# Altium schematic sheet 002_Servos.SchDoc
size A4; SheetNumber: 3; SheetTotal: 3; SPICEModelCacheWCGIBJUX: <root> / <DocumentId>WCGIBJUX</DocumentId> / <CacheFrame Number="0"> / <Model Name="0603_150060bs75003" Kind="CKT"> / <Text>****** / .subckt 0603_150060BS75003  1  2 / D1 1 2 SMCW / .MODEL SMCW D / + IS=695.94E-6 / + N=5 / + RS=2.4677 / + IKF=16.109E-12 / + CJO=1.0000E-12 / + M=.3333 / + VJ=.75 / + BV=5 / + IBV=10.00E-6 / + TT=5.0000E-9 / .ends</Text> / </Model> / <Model Name="1210_885012209048_4.7uf" Kind="CKT"> / <Text>******* / .subckt 1210_885012209048_4.7uF 1 2 / Rser 1 3 0.00278836774782 / Lser 2 4 2.60340728E-10 / C1 3 4 0.0000047 / Rpar 3 4 20000000 / .ends 1210_885012209048_4.7uF</Text> / </Model> / <Model Name="1812_885012210032_2.2uf" Kind="CKT"> / <Text>******* / .subckt 1812_885012210032_2.2uF 1 2 / Rser 1 3 0.00377371050938 / Lser 2 4 4.19292053E-10 / C1 3 4 0.0000022 / Rpar 3 4 200000000 / .ends 1812_885012210032_2.2uF</Text> / </Model> / <Model Name="0603_150060rs75003" Kind="CKT"> / <Text>****** / .subckt 0603_150060RS75003  1  2 / D1 1 2 SMCW / .MODEL SMCW D / + IS=1.0025E-15 / + N=2.2259 / + RS=.3926 / + IKF=240.91E-6 / + CJO=1.0000E-12 / + M=.3333 / + VJ=.75 / + BV=5 / + IBV=10.00E-6 / + TT=5.0000E-9 / .ends</Text> / </Model> / </CacheFrame> / </root>
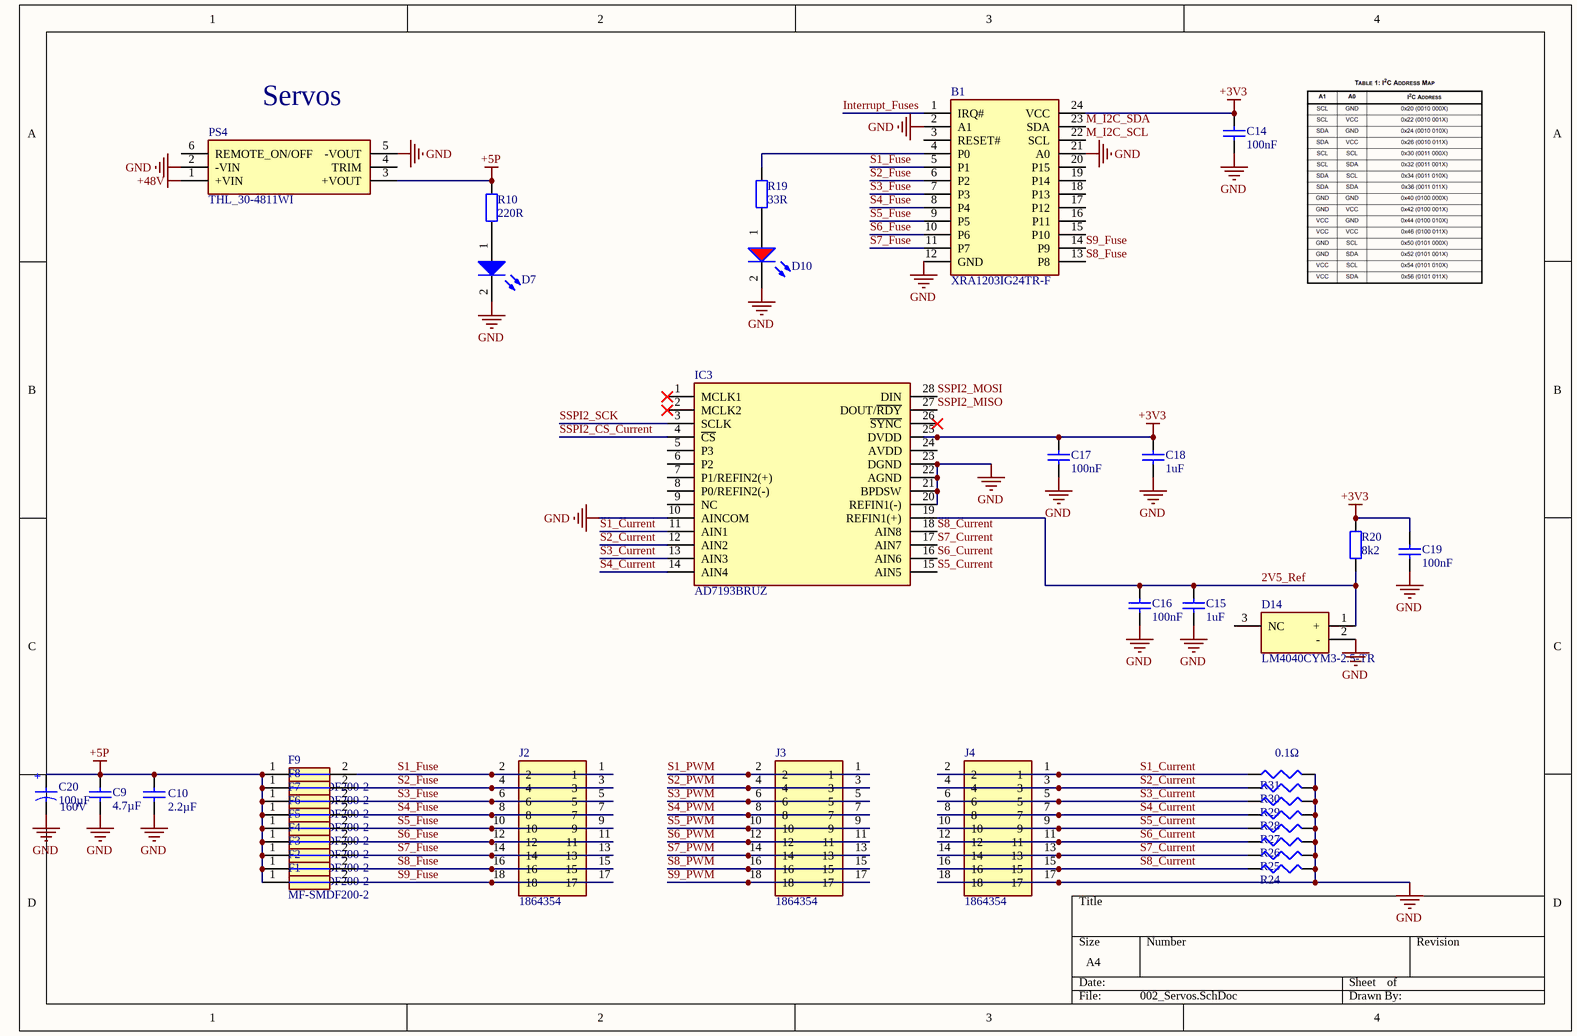
[diagram p0: 002_Servos.SchDoc]

## Parts
B1  XRA1203IG24TR-F  [SOP65P640X120-24N]
C9  4.7µF  [WCAP-CSGP_1210_L3.2W2.5H2.5]
C10  2.2µF  [WCAP-CSGP_1812_L4.5W3.2H2.5]
C14  100nF  [6-0805_L]
C15  1uF  [6-0805_L]
C16  100nF  [6-0805_L]
C17  100nF  [6-0805_L]
C18  1uF  [6-0805_L]
C19  100nF  [6-0805_L]
C20  Rated Voltage (DC): 160V  [WCAP-AT1H_D18H21]  (hidden comment: 100µF)
D7  Blue, 3.2V, 140°  [WL-SMCW_0603_150060xx75003]  (value not drawn)
D10  Red, 2V, 140°  [WL-SMCW_0603_150060xx75003]  (value not drawn)
D14  LM4040CYM3-2.5-TR  [SOT - 23]
F1  MF-SMDF200-2  [FUSC5146X85N]
F2  MF-SMDF200-2  [FUSC5146X85N]
F3  MF-SMDF200-2  [FUSC5146X85N]
F4  MF-SMDF200-2  [FUSC5146X85N]
F5  MF-SMDF200-2  [FUSC5146X85N]
F6  MF-SMDF200-2  [FUSC5146X85N]
F7  MF-SMDF200-2  [FUSC5146X85N]
F8  MF-SMDF200-2  [FUSC5146X85N]
F9  MF-SMDF200-2  [FUSC5146X85N]
IC3  AD7193BRUZ  [SOP65P640X120-28N]
J2  1864354  [1864354]
J3  1864354  [1864354]
J4  1864354  [1864354]
PS4  THL_30-4811WI  [THL304811WI]
R10  220R  [6-0805_M]
R19  33R  [6-0805_M]
R20  8k2  [6-0805_M]
R24  0.1Ω  [WRIS-KSKE_0805_L2W1.25H0.6]  (value not drawn)
R25  0.1Ω  [WRIS-KSKE_0805_L2W1.25H0.6]  (value not drawn)
R26  0.1Ω  [WRIS-KSKE_0805_L2W1.25H0.6]  (value not drawn)
R27  0.1Ω  [WRIS-KSKE_0805_L2W1.25H0.6]  (value not drawn)
R28  0.1Ω  [WRIS-KSKE_0805_L2W1.25H0.6]  (value not drawn)
R29  0.1Ω  [WRIS-KSKE_0805_L2W1.25H0.6]  (value not drawn)
R30  0.1Ω  [WRIS-KSKE_0805_L2W1.25H0.6]  (value not drawn)
R31  0.1Ω  [WRIS-KSKE_0805_L2W1.25H0.6]

## Nets
+3V3: B1.24(VCC) C14.2 C17.2 C18.2 C19.2 IC3.25(DVDD) R20.2
+5P: C9.2 C10.2 C20.1(P) F1.1 F2.1 F3.1 F4.1 F5.1 F6.1 F7.1 F8.1 F9.1 PS4.3(+VOUT) R10.2
+48V: PS4.1(+VIN)
GND: B1.2(A1) B1.12(GND) B1.21(A0) C9.1 C10.1 C14.1 C15.1 C16.1 C17.1 C18.1 C19.1 C20.2(N) D7.2(K) D10.2(K) D14.2(-) IC3.10(AINCOM) IC3.20(REFIN1(-)) IC3.21(BPDSW) IC3.22(AGND) IC3.23(DGND) J4.17 J4.18 PS4.2(-VIN) PS4.5(-VOUT) R24.2 R25.2 R26.2 R27.2 R28.2 R29.2 R30.2 R31.2
2V5_Ref: C15.2 C16.2 D14.1(+) IC3.19(REFIN1(+)) R20.1
Interrupt_Fuses: B1.1(IRQ#)
M_I2C_SCL: B1.22(SCL)
M_I2C_SDA: B1.23(SDA)
S1_Current: IC3.11(AIN1) J4.1 J4.2 R31.1
S1_Fuse: B1.5(P1) F9.2 J2.1 J2.2
S1_PWM: J3.1 J3.2
S2_Current: IC3.12(AIN2) J4.3 J4.4 R30.1
S2_Fuse: B1.6(P2) F8.2 J2.3 J2.4
S2_PWM: J3.3 J3.4
S3_Current: IC3.13(AIN3) J4.5 J4.6 R29.1
S3_Fuse: B1.7(P3) F7.2 J2.5 J2.6
S3_PWM: J3.5 J3.6
S4_Current: IC3.14(AIN4) J4.7 J4.8 R28.1
S4_Fuse: B1.8(P4) F6.2 J2.7 J2.8
S4_PWM: J3.7 J3.8
S5_Current: IC3.15(AIN5) J4.9 J4.10 R27.1
S5_Fuse: B1.9(P5) F5.2 J2.9 J2.10
S5_PWM: J3.9 J3.10
S6_Current: IC3.16(AIN6) J4.11 J4.12 R26.1
S6_Fuse: B1.10(P6) F4.2 J2.11 J2.12
S6_PWM: J3.11 J3.12
S7_Current: IC3.17(AIN7) J4.13 J4.14 R25.1
S7_Fuse: B1.11(P7) F3.2 J2.13 J2.14
S7_PWM: J3.13 J3.14
S8_Current: IC3.18(AIN8) J4.15 J4.16 R24.1
S8_Fuse: B1.13(P8) F2.2 J2.15 J2.16
S8_PWM: J3.15 J3.16
S9_Fuse: B1.14(P9) F1.2 J2.17 J2.18
S9_PWM: J3.17 J3.18
SSPI2_CS_Current: IC3.4(~{CS})
SSPI2_MISO: IC3.27(DOUT/~{RDY})
SSPI2_MOSI: IC3.28(DIN)
SSPI2_SCK: IC3.3(SCLK)
NetB1_4: B1.4(P0) R19.2
NetD7_1: D7.1(A) R10.1
NetD10_1: D10.1(A) R19.1

Not connected (* = marked no-connect by the designer): B1 3(RESET#) 15(P10) 16(P11) 17(P12) 18(P13) 19(P14) 20(P15); D14 3(NC); IC3 1(MCLK1)* 2(MCLK2)* 5(P3) 6(P2) 7(P1/REFIN2(+)) 8(P0/REFIN2(-)) 9(NC) 24(AVDD) 26(~{SYNC})*; PS4 4(TRIM) 6(REMOTE_ON/OFF)

## Notes on the sheet
- (near PS4) Servos
- (in symbol 860240981006) +

## Library data of the parts
B1 = XRA1203IG24TR-F: Interface - I/O Expanders 16 Bit I2C GPIO Expander; Manufacturer_Name: EXAR; Geometry.Height: 1.2mm; Mouser Part Number: 701-XRA1203IG24TR-F; Mouser Price/Stock: https://www.mouser.com/Search/Refine.aspx?Keyword=701-XRA1203IG24TR-F; Manufacturer_Part_Number: XRA1203IG24TR-F; Datasheet Link: https://componentsearchengine.com/Datasheets/1/XRA1203IG24TR-F.pdf
C9 = 885012209048: WCAP-CSGP Multilayer Ceramic Chip Capacitor, General Purpose, size 1210, X7R, 4.7µF, 50VDC; Manufacturer: Wurth Elektronik; Case/Size Code: 1210; Capacitance Tolerance: +/-10%; Dissipation Factor: 5%; Insulation Resistance: 0.02GΩ; Rated Voltage (DC): 50V; Technical Reference: X7R1210475K050DFCT10000; Manufacturer Part Number: 885012209048; Category: Multilayer Ceramic Chip Capacitors; Match Code: WCAP-CSGP; ComponentLink1Description: Website Link; ComponentLink1URL: https://www.we-online.com/redexpert/article/885012209048?ad; ComponentLink2Description: Datasheet Link; ComponentLink2URL: https://www.we-online.com/redexpert/spec/885012209048?ad; Mount: Surface Mount; Operating Temperature Max: 125°C; Operating Temperature Min: -55°C; Packaging: Tape and Reel; Length: 3.2mm; Width: 2.5mm; Height: 2.5mm; Capacitance: 4.7µF; Ceramic Type: X7R
C10 = 885012210032: WCAP-CSGP Multilayer Ceramic Chip Capacitor, General Purpose, size 1812, X7R, 2.2µF, 50VDC; Manufacturer: Wurth Elektronik; Case/Size Code: 1812; Capacitance Tolerance: +/-10%; Dissipation Factor: 2.5%; Insulation Resistance: 0.2GΩ; Rated Voltage (DC): 50V; Technical Reference: X7R1812225K050DFCT10000; Manufacturer Part Number: 885012210032; Category: Multilayer Ceramic Chip Capacitors; Match Code: WCAP-CSGP; ComponentLink1Description: Website Link; ComponentLink1URL: https://www.we-online.com/redexpert/article/885012210032?ad; ComponentLink2Description: Datasheet Link; ComponentLink2URL: https://www.we-online.com/redexpert/spec/885012210032?ad; Mount: Surface Mount; Operating Temperature Max: 125°C; Operating Temperature Min: -55°C; Packaging: Tape and Reel; Length: 4.5mm; Width: 3.2mm; Height: 2.5mm; Capacitance: 2.2µF; Ceramic Type: X7R
C14-C19 = Cap: Capacitor; Published: 8-Jun-2000; LatestRevisionDate: 17-Jul-2002; LatestRevisionNote: Re-released for DXP Platform.; PackageReference: RAD-0.3; Publisher: Altium Limited; PackageDescription: Radial Cap, Thru-Hole; 2 Leads; 0.3 in Pin Spacing
  C14 C16 C17 C19: Value: 100nF
  C15 C18: Value: 1uF
C20 = 860240981006: WCAP-AT1H Aluminum Electrolytic Capacitor, Radial, THT, D18 x H21mm, 100µF, 160V; Manufacturer: Wurth Elektronik; Capacitance Tolerance: +/-20%; Dissipation Factor: 15%; Endurance: 10000h; Leakage Current: 740µA; Ripple Current: 1310mA; Technical Reference: ATDL210101M160DSPAEK000; Manufacturer Part Number: 860240981006; Category: Aluminum Electrolytic Capacitors; Match Code: WCAP-AT1H; ComponentLink1Description: Website Link; ComponentLink1URL: https://www.we-online.com/redexpert/article/860240981006?ad; ComponentLink2Description: Datasheet Link; ComponentLink2URL: https://www.we-online.com/redexpert/spec/860240981006?ad; Mount: Through Hole; Operating Temperature Max: 105°C; Operating Temperature Min: -40°C; Packaging: Ammo Pack; Height: 21mm; Diameter: 18mm; Capacitance: 100µF
D7 = 150060BS75003: WL-SMCW Mono-color Chip LED Waterclear, size 0603, Blue, 3.2V, 140°; Manufacturer: Wurth Elektronik; Case/Size Code: 0603; Chip Technology: InGaN; Dominant Wavelength: 470nm; Luminous Intensity: 350mcd; Peak Wavelength: 465nm; Manufacturer Part Number: 150060BS75003; Category: Signal LEDs; Match Code: WL-SMCW; ComponentLink1Description: Website Link; ComponentLink1URL: https://www.we-online.com/redexpert/article/150060BS75003?ad; ComponentLink2Description: Datasheet Link; ComponentLink2URL: https://www.we-online.com/redexpert/spec/150060BS75003?ad; Mount: Surface Mount; Operating Temperature Max: 100°C; Operating Temperature Min: -40°C; Packaging: Tape and Reel; Length: 1.6mm; Width: 0.8mm; Height: 0.7mm; Emitting Color: Blue; Forward Voltage: 3.2V; Viewing Angle: 140°
D10 = 150060RS75003: WL-SMCW Mono-color Chip LED Waterclear, size 0603, Red, 2V, 140°; Manufacturer: Wurth Elektronik; Case/Size Code: 0603; Chip Technology: AlInGaP; Dominant Wavelength: 625nm; Luminous Intensity: 530mcd; Peak Wavelength: 630nm; Manufacturer Part Number: 150060RS75003; Category: Signal LEDs; Match Code: WL-SMCW; ComponentLink1Description: Website Link; ComponentLink1URL: https://www.we-online.com/redexpert/article/150060RS75003?ad; ComponentLink2Description: Datasheet Link; ComponentLink2URL: https://www.we-online.com/redexpert/spec/150060RS75003?ad; Mount: Surface Mount; Operating Temperature Max: 100°C; Operating Temperature Min: -40°C; Packaging: Tape and Reel; Length: 1.6mm; Width: 0.8mm; Height: 0.7mm; Emitting Color: Red; Forward Voltage: 2V; Viewing Angle: 140°
D14 = LM4040CYM3-2.5-TR: Integrated Circuit; Manufacturer_Name: Microchip; Datasheet Link: https://componentsearchengine.com/Datasheets/1/LM4040CYM3-2.5-TR.pdf; Height: 1.11mm; Manufacturer_Part_Number: LM4040CYM3-2.5-TR; Mouser Part Number: 998-LM4040CYM3-2.5TR; Mouser Price/Stock: https://www.mouser.co.uk/ProductDetail/Microchip-Technology/LM4040CYM3-2.5-TR?qs=Y3Q3JoKAO1TBY3WS5dYgqA%3D%3D; Arrow Part Number: LM4040CYM3-2.5-TR; Arrow Price/Stock: https://www.arrow.com/en/products/lm4040cym3-2.5-tr/microchip-technology?region=nac
F1-F9 = MF-SMDF200-2: Fuse; Manufacturer_Name: Bourns; Datasheet Link: https://www.bourns.com/docs/product-datasheets/mf-smdf.pdf?sfvrsn=df432e3c_40; Height: 0.85mm; Manufacturer_Part_Number: MF-SMDF200-2; Mouser Part Number: 652-MF-SMDF200-2; Mouser Price/Stock: https://www.mouser.co.uk/ProductDetail/Bourns/MF-SMDF200-2?qs=NmEazmuVvbUP9opuVlBLcQ%3D%3D; Arrow Part Number: MF-SMDF200-2; Arrow Price/Stock: https://www.arrow.com/en/products/mf-smdf200-2/bourns?region=nac
IC3 = AD7193BRUZ: Integrated Circuit; Manufacturer_Name: Analog Devices; Datasheet Link: https://www.arrow.com/en/products/ad7193bruz/analog-devices; Height: 1.2mm; Manufacturer_Part_Number: AD7193BRUZ; Mouser Part Number: 584-AD7193BRUZ; Mouser Price/Stock: https://www.mouser.co.uk/ProductDetail/Analog-Devices/AD7193BRUZ?qs=NmRFExCfTkGSEOyDxDZl1A%3D%3D; Arrow Part Number: AD7193BRUZ; Arrow Price/Stock: https://www.arrow.com/en/products/ad7193bruz/analog-devices?region=nac
J2-J4 = 1864354: Conn Terminal Block 9 POS 3.5mm Spring Clamp Thru-Hole 13.5A; Manufacturer_Name: Phoenix Contact; Geometry.Height: 10.9mm; Manufacturer_Part_Number: 1864354; Mouser Part Number: 651-1864354; Mouser Price/Stock: https://www.mouser.co.uk/ProductDetail/Phoenix-Contact/1864354?qs=K5ytOU5dogooOTFQbYZG6w%3D%3D; Arrow Part Number: 1864354; Arrow Price/Stock: https://www.arrow.com/en/products/1864354/phoenix-contact; Datasheet Link: https://datasheet.datasheetarchive.com/originals/distributors/DKDS-31/613782.pdf
PS4 = THL_30-4811WI: Power Supply; Manufacturer_Name: Traco Power; Manufacturer_Part_Number: THL 30-4811WI; Datasheet Link: https://tracopower.com/thl30wi-datasheet/; Height: 10.7mm; Mouser Part Number: 495-THL30-4811WI; Mouser Price/Stock: https://www.mouser.co.uk/ProductDetail/TRACO-Power/THL-30-4811WI?qs=Y0Uzf4wQF3nJ2IvHzeZgKg%3D%3D
R10 R19 R20 = Res2: Resistor; Published: 8-Jun-2000; LatestRevisionDate: 17-Jul-2002; LatestRevisionNote: Re-released for DXP Platform.; PackageReference: AXIAL-0.4; Publisher: Altium Limited; PackageDescription: Axial Device, Thru-Hole; 2 Leads; 0.4 in Pin Spacing
  R10: Value: 220R
  R19: Value: 33R
  R20: Value: 8k2
R24-R31 = 560050320001: WRIS-KSKE Thick Film Resistor, SMT, size 0805, 0.33W, 0.1Ω, +/-1%; Manufacturer: Wurth Elektronik; Case/Size Code: 0805; Rated Current: 1.81A; Technical Reference: KE0805R100F103LAATP0000; Temperature Coefficient of Resistance: 250ppm/°C; Manufacturer Part Number: 560050320001; Category: Thick Film Resistors; Match Code: WRIS-KSKE; ComponentLink1Description: Website Link; ComponentLink1URL: https://www.we-online.com/redexpert/article/560050320001?ad; ComponentLink2Description: Datasheet Link; ComponentLink2URL: https://www.we-online.com/redexpert/spec/560050320001?ad; Mount: Surface Mount; Operating Temperature Max: 155°C; Operating Temperature Min: -55°C; Packaging: Tape and Reel; Length: 2mm; Width: 1.25mm; Height: 0.6mm; Rated Power: 0.33W; Resistance: 0.1Ω; Resistance Tolerance: +/-1%